# EAGLE design pwramp (EAGLE 5.07)
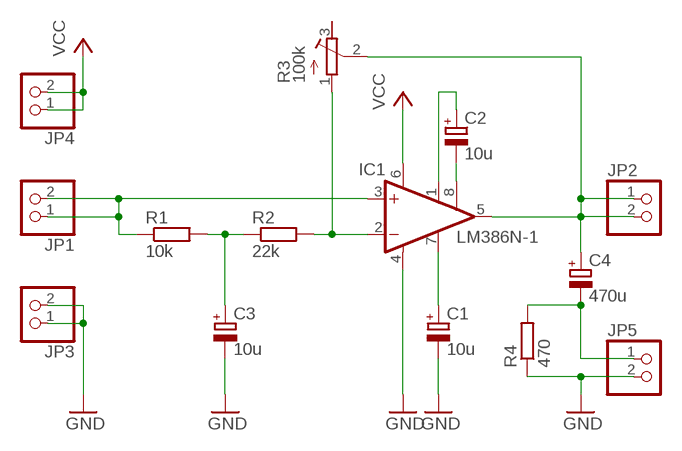
[diagram p0: schematic, sheet 1]

## Parts
C1  10u  CPOL-EUE2-5  [E2-5]
C2  10u  CPOL-EUE2-5  [E2-5]
C3  10u  CPOL-EUE2-5  [E2-5]
C4  470u  CPOL-EUE5-10.5  [E5-10,5]
IC1  LM386N-1  [DIL08]
JP1  PINHD-1X2  [1X02]
JP2  PINHD-1X2  [1X02]
JP3  PINHD-1X2  [1X02]
JP4  PINHD-1X2  [1X02]
JP5  PINHD-1X2  [1X02]
R1  10k  R-EU_0204/7  [0204/7]
R2  22k  R-EU_0204/7  [0204/7]
R3  100k  R-TRIMM3296P  [RTRIM3296P]
R4  470  R-EU_0204/7  [0204/7]

## Nets
GND: C1.- C3.- IC1.4(GND) JP3.1 JP3.2 JP5.2 R4.1
N$1: C2.- IC1.8(GAIN)
N$2: C2.+ IC1.1(GAIN)
N$3: C3.+ R1.2 R2.1
N$4: IC1.3(+IN) JP1.1 JP1.2 R1.1
N$5: IC1.2(-IN) R2.2 R3.1(E)
N$6: C1.+ IC1.7(BYPASS)
N$7: C4.- JP5.1 R4.2
N$8: C4.+ IC1.5(OUT) JP2.1 JP2.2 R3.2(S)
VCC: IC1.6(VS) JP4.1 JP4.2
Unconnected: R3.3(A)

## Library data of the parts
C1-C4 = resistor:CPOL-EU: POLARIZED CAPACITOR, European symbol
IC1 = linear:LM386?-*: Low Voltage Audio Power Amplifier Source: http://cache.national.com/ds/LM/LM386.pdf
JP1-JP5 = pinhead:PINHD-1X2: PIN HEADER
R1 R2 R4 = resistor:R-EU_: RESISTOR, European symbol
R3 = resistor:R-TRIMM: Trimm resistor

## Board
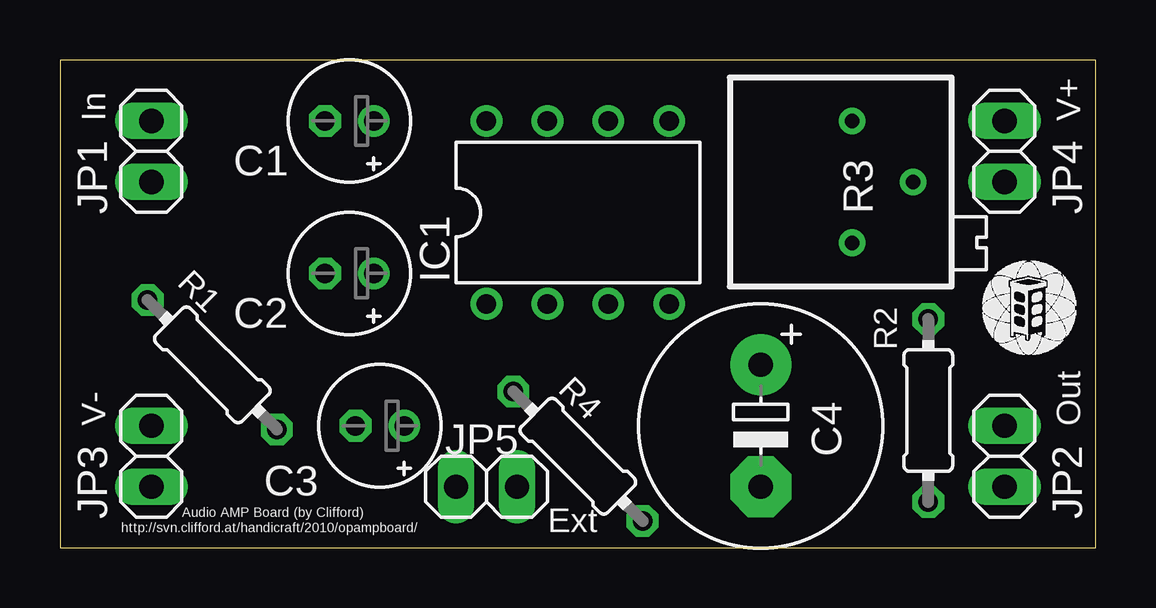
[diagram p1: board, top side]
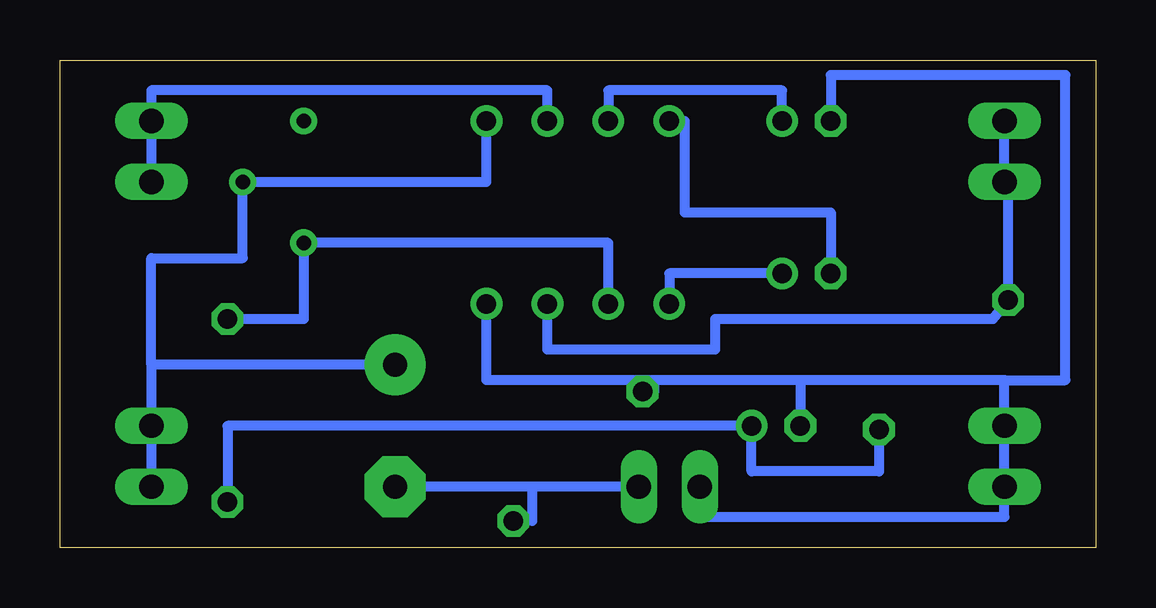
[diagram p2: board, bottom side, seen from below]

Size 43.18 x 20.32 mm. Coordinates in mm from the lower left corner, seen from the top.
Outline: 0,0 43.18,0 43.18,20.32 0,20.32 0,0
Copper layers (1*16): Top 0.035mm / dielectric 1.5mm / Bottom 0.035mm
Design rules "default": minimum track width 10mil, minimum drill 24mil, track to track 8mil, track to pad 8mil, pad to pad 8mil, via to via 8mil, smd to smd 8mil, copper to edge 40mil, drill to drill 8mil, minimum pad ring 10mil, minimum via ring 8mil, stop-mask expansion 4mil, vias tented up to drill 0mil, thermal gap 10mil

### Footprints (pad centres in the part's own frame; a part is rotated, then mirrored left to right if it is on the bottom)
E2-5 = drill 0.813 pad 1.27 round: + -1.016,0 | drill 0.813 pad 1.27 octagon: - 1.016,0
E5-10,5 = drill 1.016 pad 2.54 round: + -2.54,0 | drill 1.016 pad 2.54 octagon: - 2.54,0
DIL08 = drill 0.813 pad 1.27 round: 1 -3.81,-3.81; 2 -1.27,-3.81; 3 1.27,-3.81; 4 3.81,-3.81; 5 3.81,3.81; 6 1.27,3.81; 7 -1.27,3.81; 8 -3.81,3.81
1X02 = drill 1.016 long: 1 -1.27,0; 2 1.27,0
0204/7 = drill 0.813 octagon: 1 -3.81,0; 2 3.81,0
RTRIM3296P = drill 0.61 round: 1 0,-2.54; 2 2.54,0; 3 0,2.54

### Placement (x,y rotation side)
C1  12.06,17.78 180 top
C2  12.06,11.43 180 top
C3  13.34,5.08 180 top
C4  29.21,5.08 270 top
IC1  21.59,13.97 0 top
JP1  3.81,16.51 90 top
JP2  39.37,3.81 90 top
JP3  3.81,3.81 90 top
JP4  39.37,16.51 90 top
JP5  17.78,2.54 180 top
R1  6.35,7.62 315 top
R2  36.2,5.71 90 top
R3  33.02,15.24 0 top
R4  21.59,3.81 315 top

### Tracks (layer width: path | path; a pad name or v marks a point on that pad's centre or on a via)
GND
  Bottom 0.406: JP5.2 16.51,1.27 3.81,1.27 JP3.1 JP3.2 3.81,6.99 | IC1.4 25.4,6.99 18.41,6.99 | 12.32,6.99 18.41,6.99 | 12.32,6.99 C3.- | 3.81,6.99 12.32,6.99 | C1.- 11.05,19.68 1.27,19.68 1.27,6.99 3.81,6.99 | R4.1 18.41,6.5 18.41,6.99
N$1
  Bottom 0.406: IC1.8 17.14,17.78 17.14,13.97 11.05,13.97 C2.-
N$2
  Bottom 0.406: C2.+ 17.78,11.43 IC1.1
N$3
  Bottom 0.406: R1.2 9.04,3.17 14.35,3.17 C3.+ 36.2,5.08 R2.1
N$4
  Bottom 0.406: JP1.2 JP1.1 3.66,15.24 R1.1 4.29,9.53 15.88,9.53 15.88,8.26 22.86,8.26 IC1.3
N$5
  Bottom 0.406: IC1.2 20.32,12.7 R3.1 33.02,9.53 R2.2
N$6
  Bottom 0.406: IC1.7 20.32,19.05 13.08,19.05 C1.+
N$7
  Bottom 0.406: JP5.1 23.5,2.54 | 23.5,2.54 C4.- | R4.2 23.5,1.12 23.5,2.54
N$8
  Bottom 0.406: IC1.5 25.4,15.24 R3.2 35.56,12.06 39.37,12.06 39.37,7.62 | 39.37,7.62 JP2.2 JP2.1 | C4.+ 39.37,7.62
VCC
  Bottom 0.406: IC1.6 22.86,19.05 39.37,19.05 JP4.2 JP4.1

### Text on the board
tPlace: In | V+ | V- | Out | http://svn.clifford.at/handicraft/2010/opampboard/ | Audio AMP Board (by Clifford) | Ext